# Altium schematic sheet Board.SchDoc
size A4
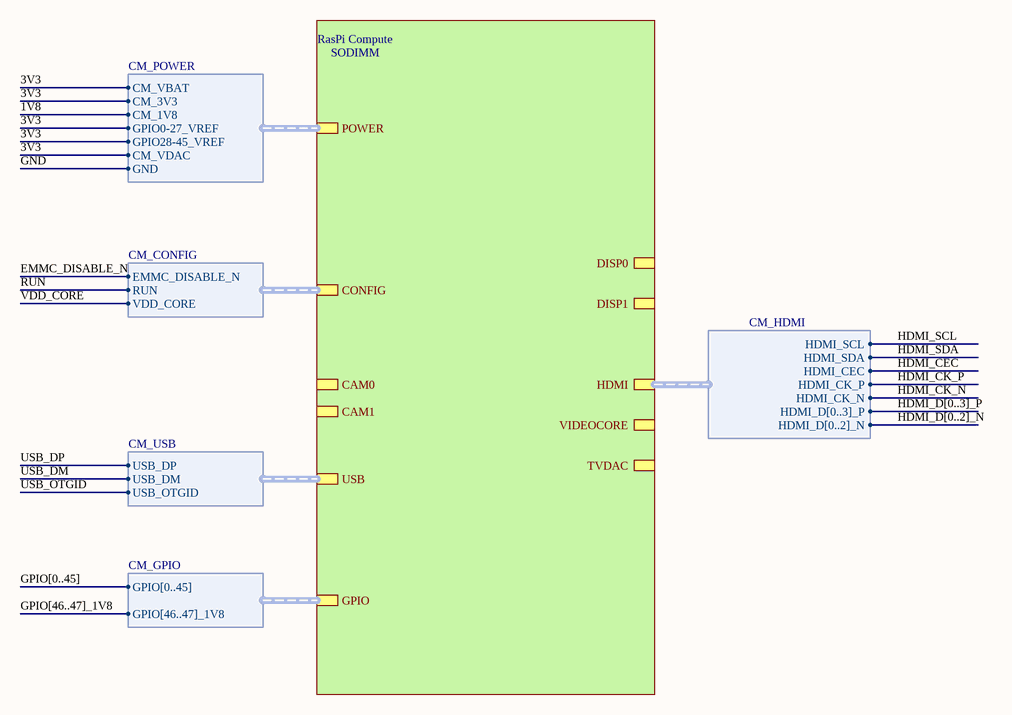
[diagram p0: Board.SchDoc]

## Sub-sheets
RasPi Compute = SODIMM: GPIO (harness CM_GPIO), CONFIG (harness CM_CONFIG), CAM0 (harness CM_CAM0), POWER (harness CM_POWER), CAM1 (harness CM_CAM1), DISP0 (harness CM_DISP0), DISP1 (harness CM_DISP1), HDMI (harness CM_HDMI), USB (harness CM_USB), VIDEOCORE (harness CM_VC), TVDAC (harness CM_TVDAC)

## Harnesses
CM_GPIO: GPIO[0..45], GPIO[46..47]_1V8
CM_CONFIG: EMMC_DISABLE_N, RUN, VDD_CORE
CM_POWER: CM_VBAT, CM_3V3, CM_1V8, GPIO0-27_VREF, GPIO28-45_VREF, CM_VDAC, GND
CM_USB: USB_DP, USB_DM, USB_OTGID
CM_HDMI: HDMI_D[0..2]_N, HDMI_D[0..3]_P, HDMI_CK_N, HDMI_CK_P, HDMI_CEC, HDMI_SDA, HDMI_SCL

## Nets
1V8: sheet RasPi Compute/POWER.CM_1V8
3V3: sheet RasPi Compute/POWER.CM_VBAT, sheet RasPi Compute/POWER.CM_3V3, sheet RasPi Compute/POWER.GPIO0-27_VREF, sheet RasPi Compute/POWER.GPIO28-45_VREF, sheet RasPi Compute/POWER.CM_VDAC
EMMC_DISABLE_N: sheet RasPi Compute/CONFIG.EMMC_DISABLE_N
GND: sheet RasPi Compute/POWER.GND
HDMI_CEC: sheet RasPi Compute/HDMI.HDMI_CEC
HDMI_CK_N: sheet RasPi Compute/HDMI.HDMI_CK_N
HDMI_CK_P: sheet RasPi Compute/HDMI.HDMI_CK_P
HDMI_SCL: sheet RasPi Compute/HDMI.HDMI_SCL
HDMI_SDA: sheet RasPi Compute/HDMI.HDMI_SDA
RUN: sheet RasPi Compute/CONFIG.RUN
USB_DM: sheet RasPi Compute/USB.USB_DM
USB_DP: sheet RasPi Compute/USB.USB_DP
USB_OTGID: sheet RasPi Compute/USB.USB_OTGID
VDD_CORE: sheet RasPi Compute/CONFIG.VDD_CORE

## Buses and harness runs
bus GPIO[0..45]
bus GPIO[46..47]_1V8
bus HDMI_D[0..2]_N
bus HDMI_D[0..3]_P